# EAGLE design schematic (EAGLE 9.6.2)

## Sheet 1 of 2
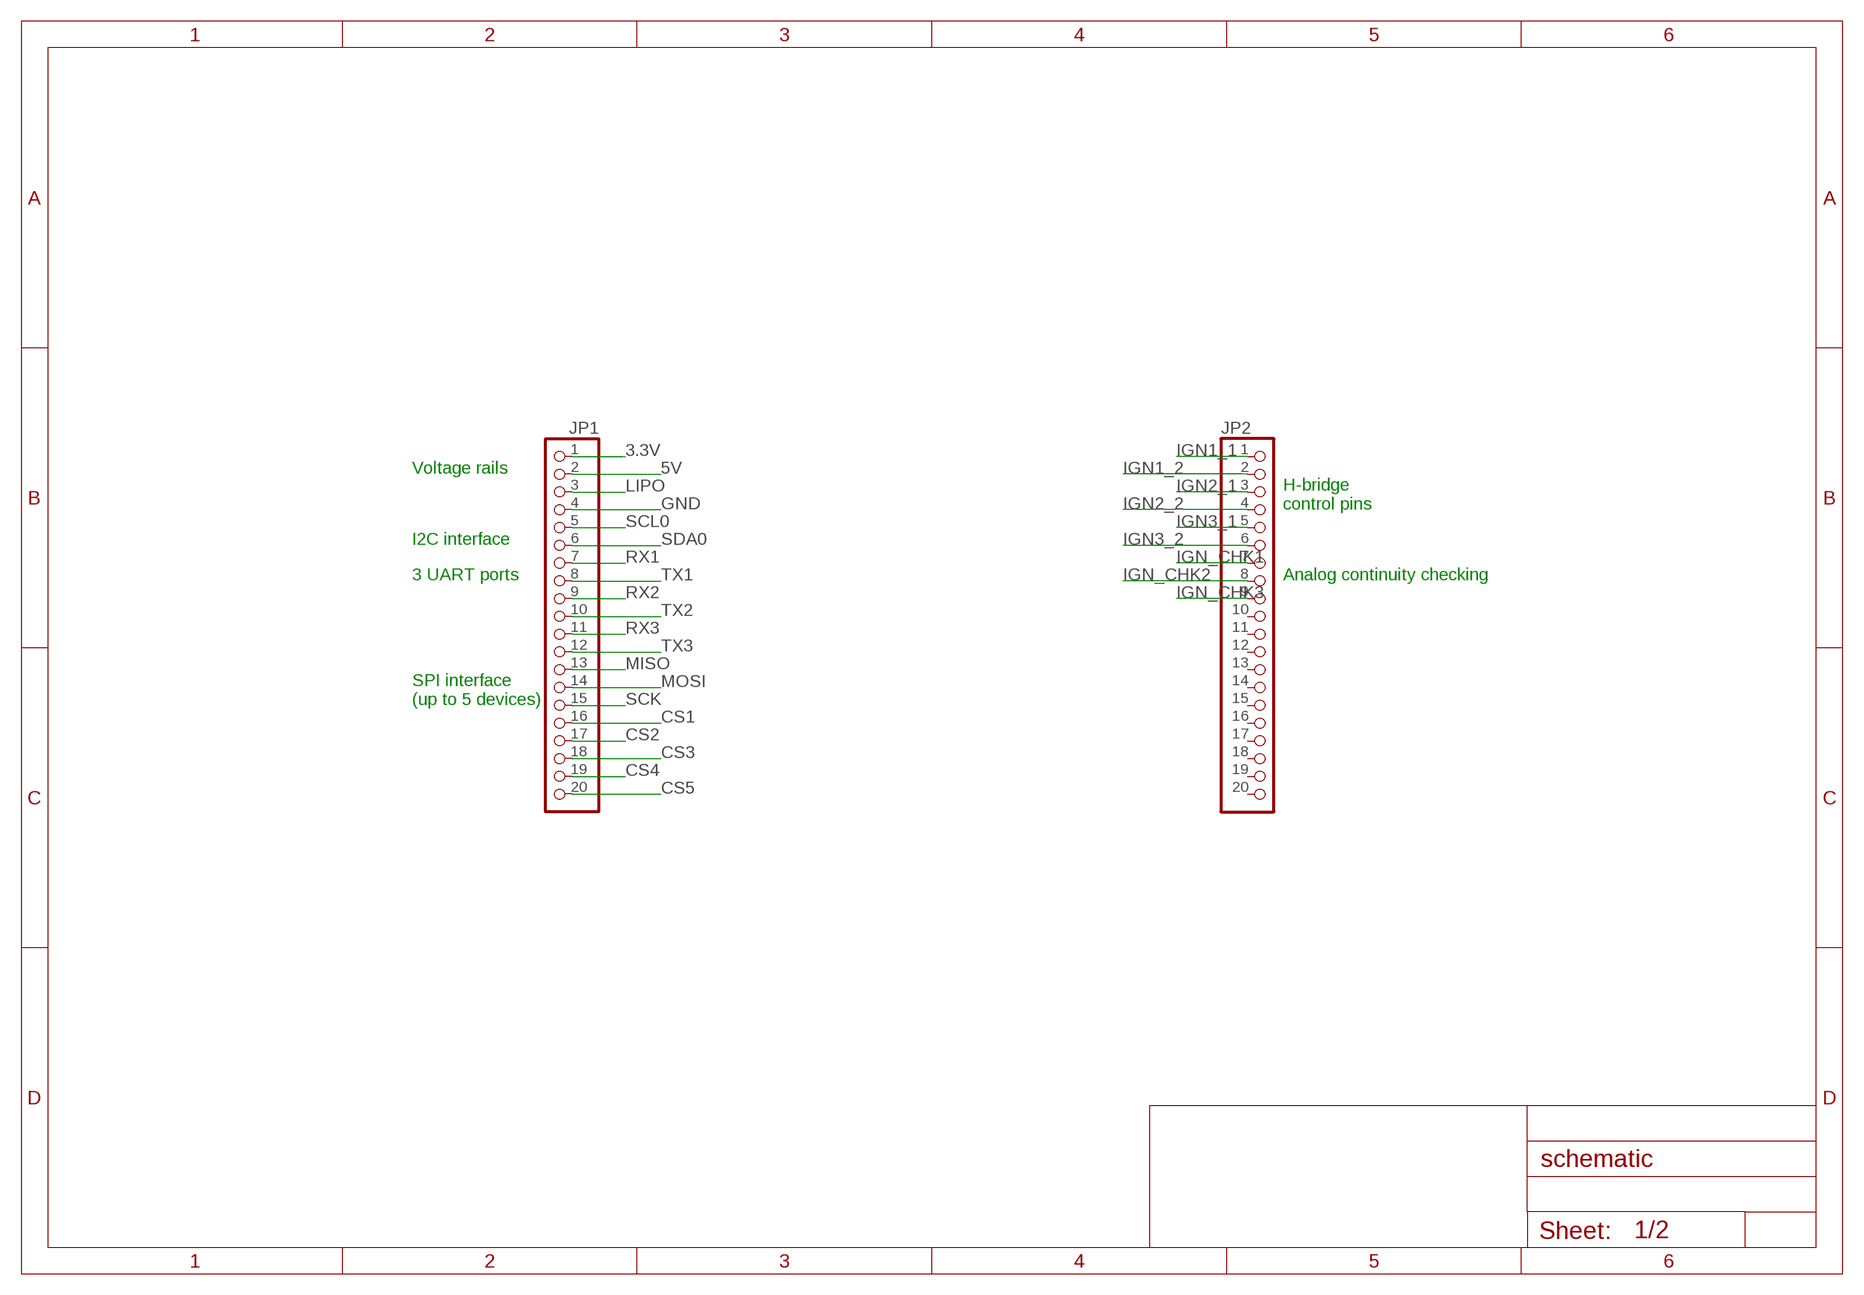
[diagram p0: schematic, sheet 1]

### Parts
JP1  PINHD-1X20  [1X20]
JP2  PINHD-1X20  [1X20]

### Nets
3.3V: JP1.1 ; also sheet 2
5V: JP1.2
CS1: JP1.16
CS2: JP1.17
CS3: JP1.18
CS4: JP1.19
CS5: JP1.20
GND: JP1.4 ; also sheet 2
IGN1_1: JP2.1 ; also sheet 2
IGN1_2: JP2.2 ; also sheet 2
IGN2_1: JP2.3 ; also sheet 2
IGN2_2: JP2.4 ; also sheet 2
IGN3_1: JP2.5 ; also sheet 2
IGN3_2: JP2.6 ; also sheet 2
IGN_CHK1: JP2.7 ; also sheet 2
IGN_CHK2: JP2.8 ; also sheet 2
IGN_CHK3: JP2.9 ; also sheet 2
LIPO: JP1.3 ; also sheet 2
MISO: JP1.13
MOSI: JP1.14
RX1: JP1.7 ; also sheet 2
RX2: JP1.9 ; also sheet 2
RX3: JP1.11
SCK: JP1.15
SCL0: JP1.5 ; also sheet 2
SDA0: JP1.6 ; also sheet 2
TX1: JP1.8 ; also sheet 2
TX2: JP1.10 ; also sheet 2
TX3: JP1.12
Unconnected: JP2.10 JP2.11 JP2.12 JP2.13 JP2.14 JP2.15 JP2.16 JP2.17 JP2.18 JP2.19 JP2.20

### Notes on the sheet
- Voltage rails
- H-bridge
  control pins
- I2C interface
- 3 UART ports | Analog continuity checking
- SPI interface
  (up to 5 devices)

## Sheet 2 of 2
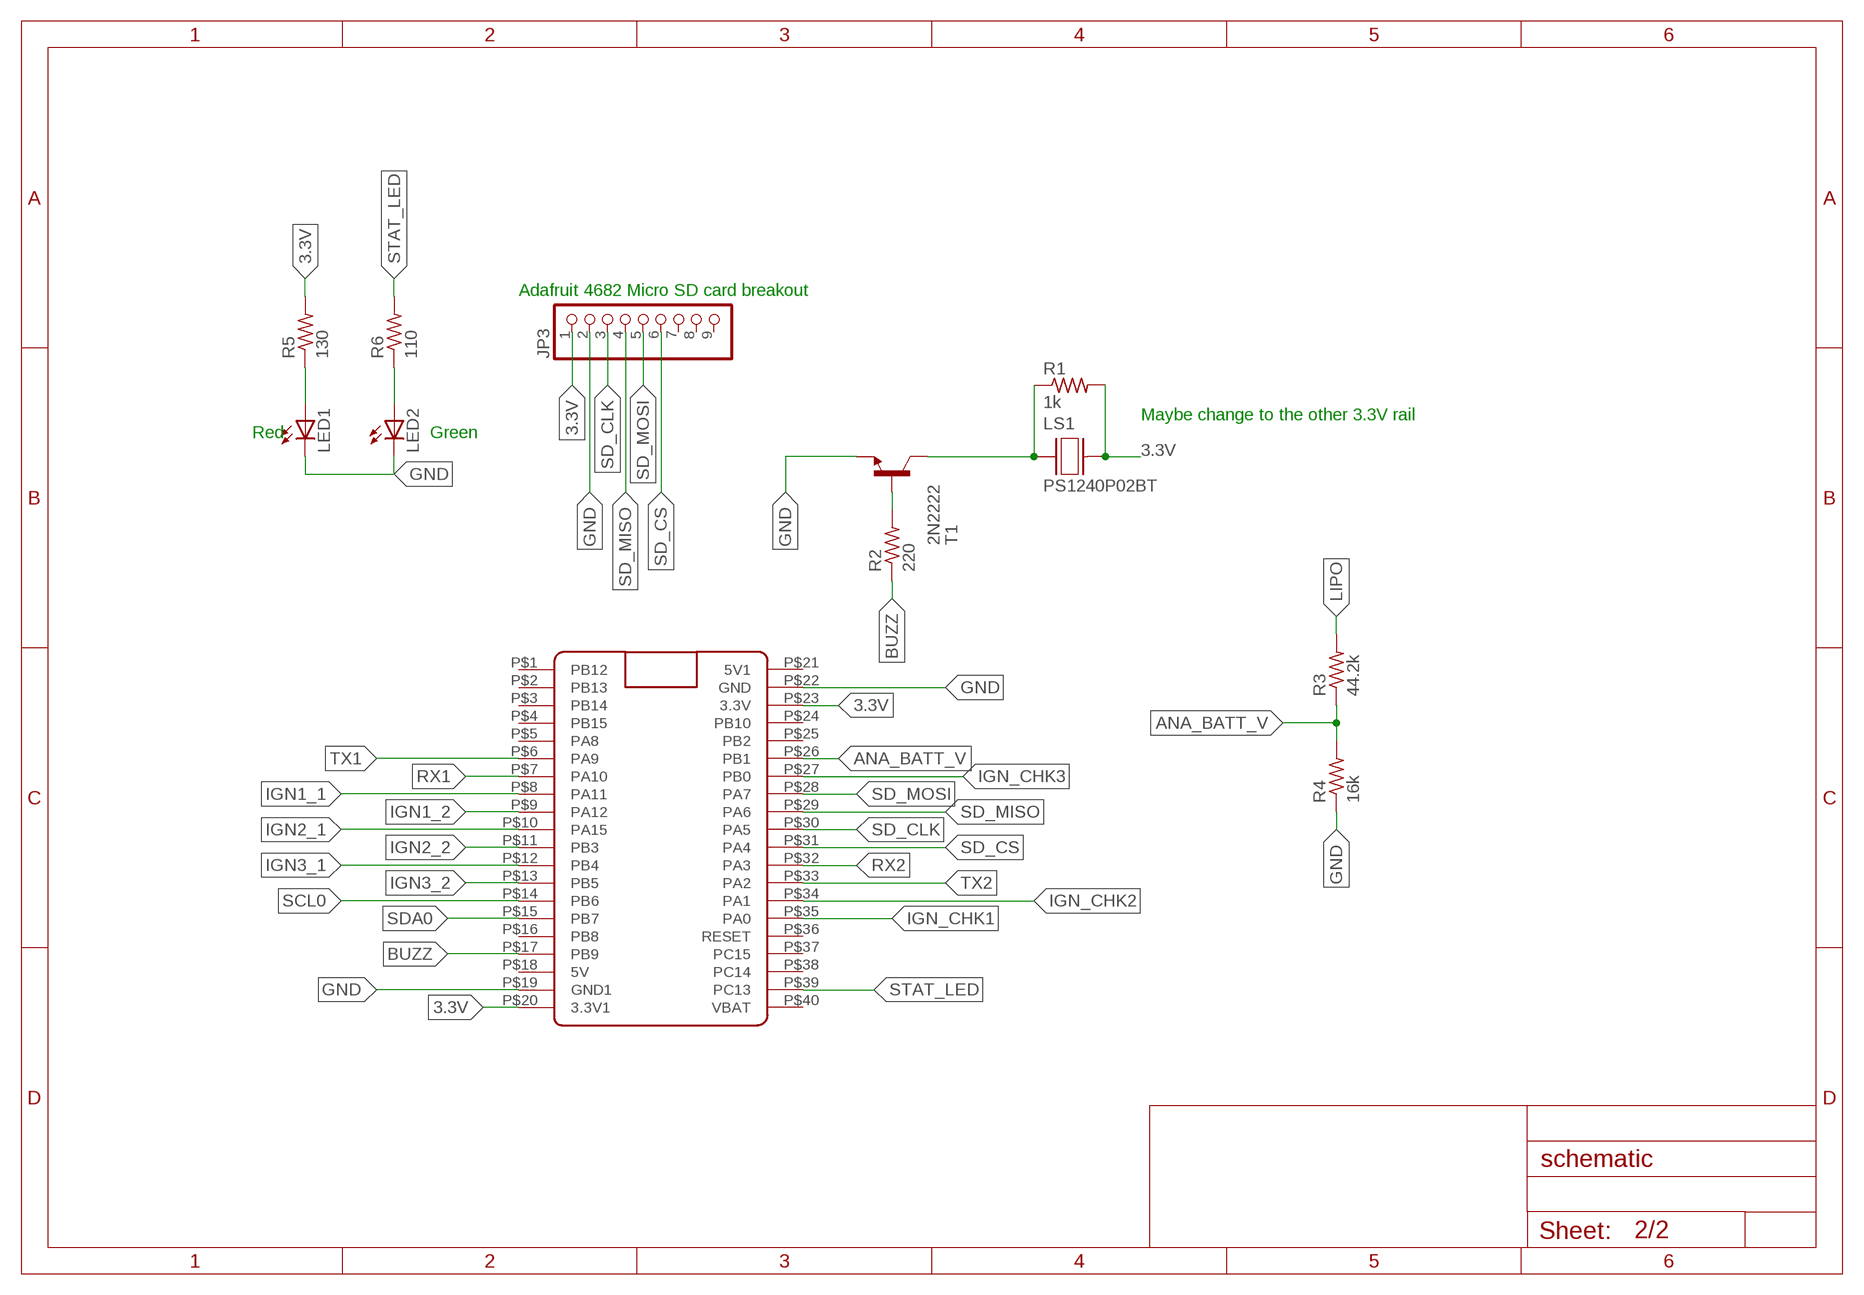
[diagram p1: schematic, sheet 2]

### Parts
JP3  PINHD-1X9  [1X09-BIG]
LED1  LED5MM  [LED5MM]
LED2  LED5MM  [LED5MM]
LS1  PS1240P02BT  [XDCR_PS1240P02BT]
R1  1k  R-US_0204/7  [0204/7]
R2  220  R-US_0204/7  [0204/7]
R3  44.2k  R-US_0204/7  [0204/7]
R4  16k  R-US_0204/7  [0204/7]
R5  130  R-US_0204/7  [0204/7]
R6  110  R-US_0204/7  [0204/7]
T1  2N2222  [TO92-EBC-OVAL]
U$1  BLACK_PILL  [BLACK_PILL]

### Nets
3.3V: JP3.1 LS1.2 R1.2 R5.2 U$1.P$20(3.3V1) U$1.P$23(3.3V) ; also sheet 1
ANA_BATT_V: R3.1 R4.2 U$1.P$26(PB1)
BUZZ: R2.1 U$1.P$17(PB9)
GND: JP3.2 LED1.K(C) LED2.K(C) R4.1 T1.E U$1.P$19(GND1) U$1.P$22(GND) ; also sheet 1
IGN1_1: U$1.P$8(PA11) ; also sheet 1
IGN1_2: U$1.P$9(PA12) ; also sheet 1
IGN2_1: U$1.P$10(PA15) ; also sheet 1
IGN2_2: U$1.P$11(PB3) ; also sheet 1
IGN3_1: U$1.P$12(PB4) ; also sheet 1
IGN3_2: U$1.P$13(PB5) ; also sheet 1
IGN_CHK1: U$1.P$35(PA0) ; also sheet 1
IGN_CHK2: U$1.P$34(PA1) ; also sheet 1
IGN_CHK3: U$1.P$27(PB0) ; also sheet 1
LIPO: R3.2 ; also sheet 1
N$2: LS1.1 R1.1 T1.C
N$3: LED1.A R5.1
N$4: R2.2 T1.B
N$5: LED2.A R6.1
RX1: U$1.P$7(PA10) ; also sheet 1
RX2: U$1.P$32(PA3) ; also sheet 1
SCL0: U$1.P$14(PB6) ; also sheet 1
SD_CLK: JP3.3 U$1.P$30(PA5)
SD_CS: JP3.6 U$1.P$31(PA4)
SD_MISO: JP3.4 U$1.P$29(PA6)
SD_MOSI: JP3.5 U$1.P$28(PA7)
SDA0: U$1.P$15(PB7) ; also sheet 1
STAT_LED: R6.2 U$1.P$39(PC13)
TX1: U$1.P$6(PA9) ; also sheet 1
TX2: U$1.P$33(PA2) ; also sheet 1
Unconnected: JP3.7 JP3.8 JP3.9 U$1.P$1(PB12) U$1.P$2(PB13) U$1.P$3(PB14) U$1.P$4(PB15) U$1.P$5(PA8) U$1.P$16(PB8) U$1.P$18(5V) U$1.P$21(5V1) U$1.P$24(PB10) U$1.P$25(PB2) U$1.P$36(RESET) U$1.P$37(PC15) U$1.P$38(PC14) U$1.P$40(VBAT)

### Notes on the sheet
- Adafruit 4682 Micro SD card breakout
- Maybe change to the other 3.3V rail
- Red | Green

## Library data of the parts
JP1 JP2 = adafruit:PINHD-1X20: PIN HEADER
JP3 = adafruit:PINHD-1X9: Pin header 1x10 0.1" spacing With round pins
LED1 LED2 = adafruit:LED: LED OSRAM: - CHIPLED LG R971, LG N971, LY N971, LG Q971, LY Q971, LO R971, LY R971 LH N974, LH R974 LS Q976, LO Q976, LY Q976 LO Q996 - Hyper CHIPLED LW Q18S LB Q993, LB Q99A, LB R99A - SideLED LS A670, LO A670, LY A670, LG A670, LP A670 LB A673, LV A673, LT A673, LW A673 LH A674 LY A675 LS A676, LA A676, LO A676, LY A676, LW A676 LS A679, LY A679, LG A679 - Hyper Micro SIDELED® LS Y876, LA Y876, LO Y876, LY Y876 LT Y87S - SmartLED LW L88C, LW L88S LB L89C, LB L89S, LG L890 LS L89K, LO L89K, LY L89K LS L896, LA L896, LO L896, LY L896 - TOPLED LS T670, LO T670, LY T670, LG T670, LP T670 LSG T670, LSP T670, LSY T670, LOP T670, LYG T670 LG T671, LOG T671, LSG T671 LB T673, LV T673, LT T673, LW T673 LH T674 LS T676, LA T676, LO T676, LY T676, LB T676, LH T676, LSB T676, LW T676 LB T67C, LV T67C, LT T67C, LS T67K, LO T67K, LY T67K, LW E67C LS E67B, LA E67B, LO E67B, LY E67B, LB E67C, LV E67C, LT E67C LW T67C LS T679, LY T679, LG T679 LS T770, LO T770, LY T770, LG T770, LP T770 LB T773, LV T773, LT T773, LW T773 LH T774 LS E675, LA E675, LY E675, LS T675 LS T776, LA T776, LO T776, LY T776, LB T776 LHGB T686 LT T68C, LB T68C - Hyper Mini TOPLED® LB M676 - Mini TOPLED Santana® LG M470 LS M47K, LO M47K, LY M47K Source: http://www.osram.convergy.de/
LS1 = PS1240P02BT:PS1240P02BT: Buzzers Transducer, Externally Driven Piezo 3V 4kHz 60dB @ 3V, 10cm Through Hole PC Pins Check availability <https://pricing.snapeda.com/parts/PS1240P02BT/TDK/view-part?ref=eda>; AVAILABILITY: In Stock; DESCRIPTION: Buzzers Transducer, Externally Driven Piezo 3 V - 4kHz 60dB @ 3V, 10cm Through Hole PC Pins; MF: TDK; MP: PS1240P02BT; PACKAGE: None; PRICE: None; PURCHASE-URL: https://pricing.snapeda.com/search/part/PS1240P02BT/?ref=eda
R1-R6 = adafruit:R-US_: RESISTOR, American symbol
T1 = adafruit:2N2222: NPN TRANSISTOR Big oval pads
U$1 = BluePill:BLACK_PILL

## Board
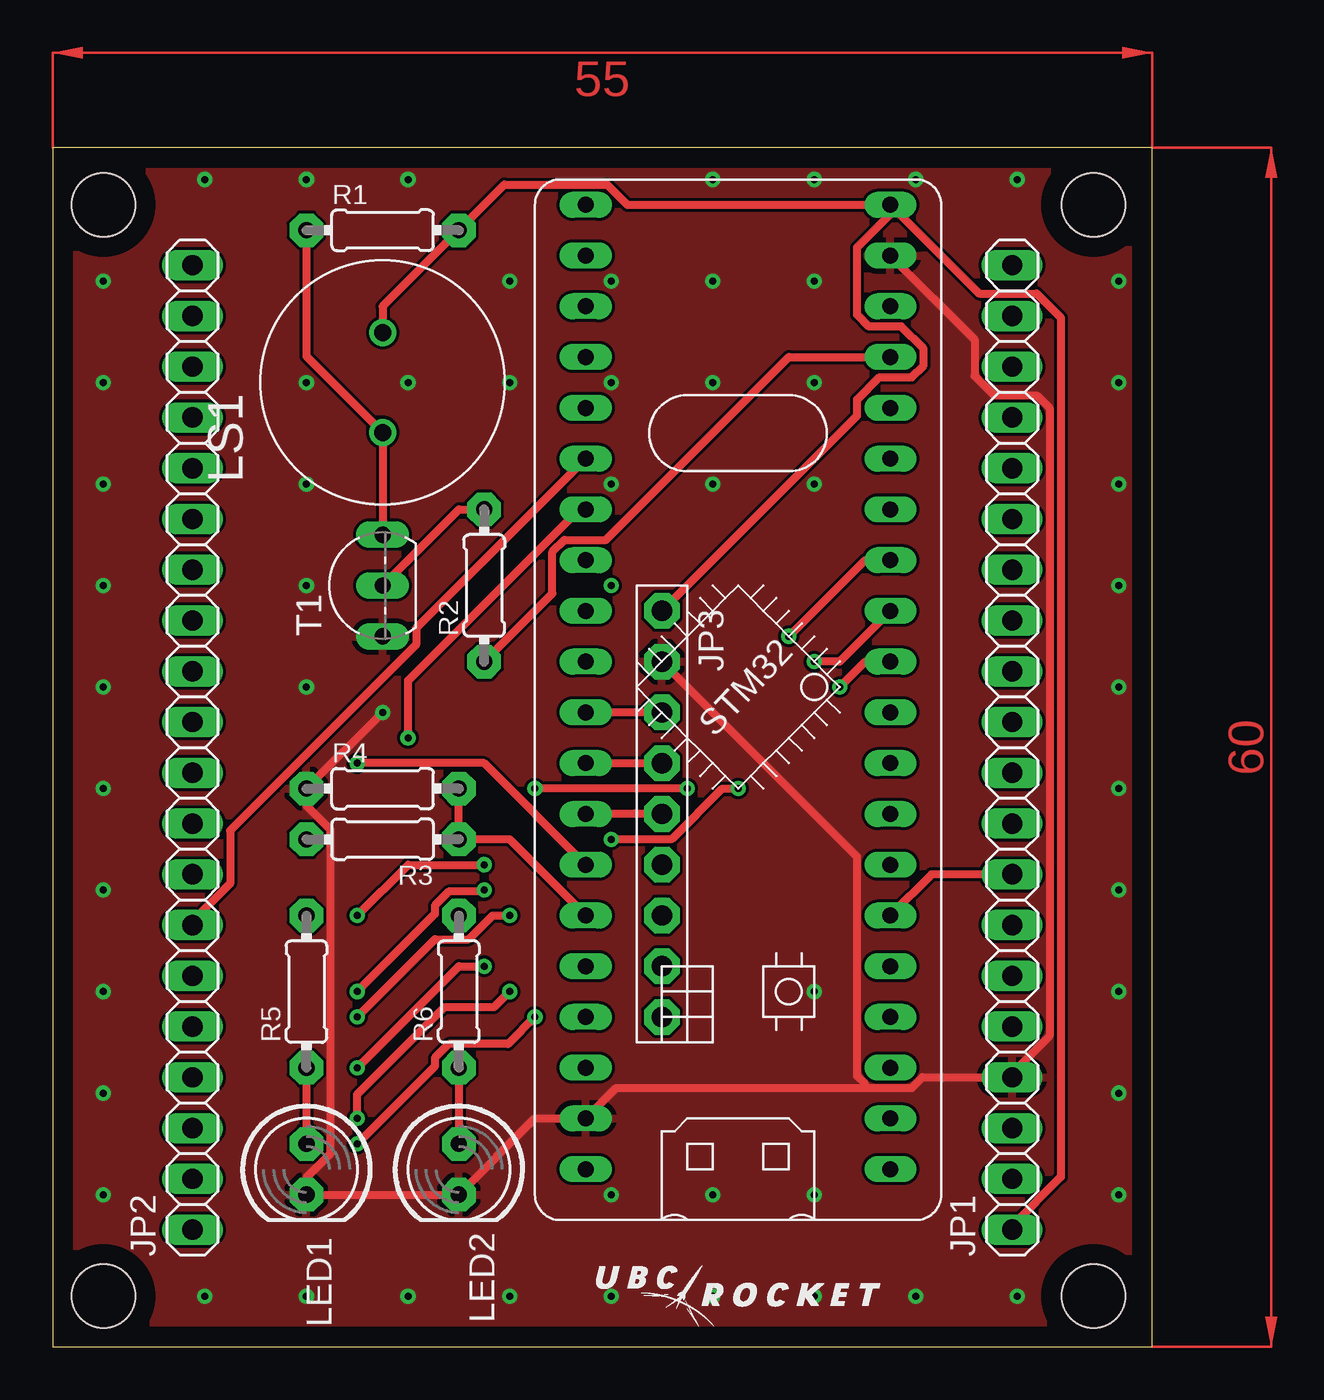
[diagram p2: board, top side]
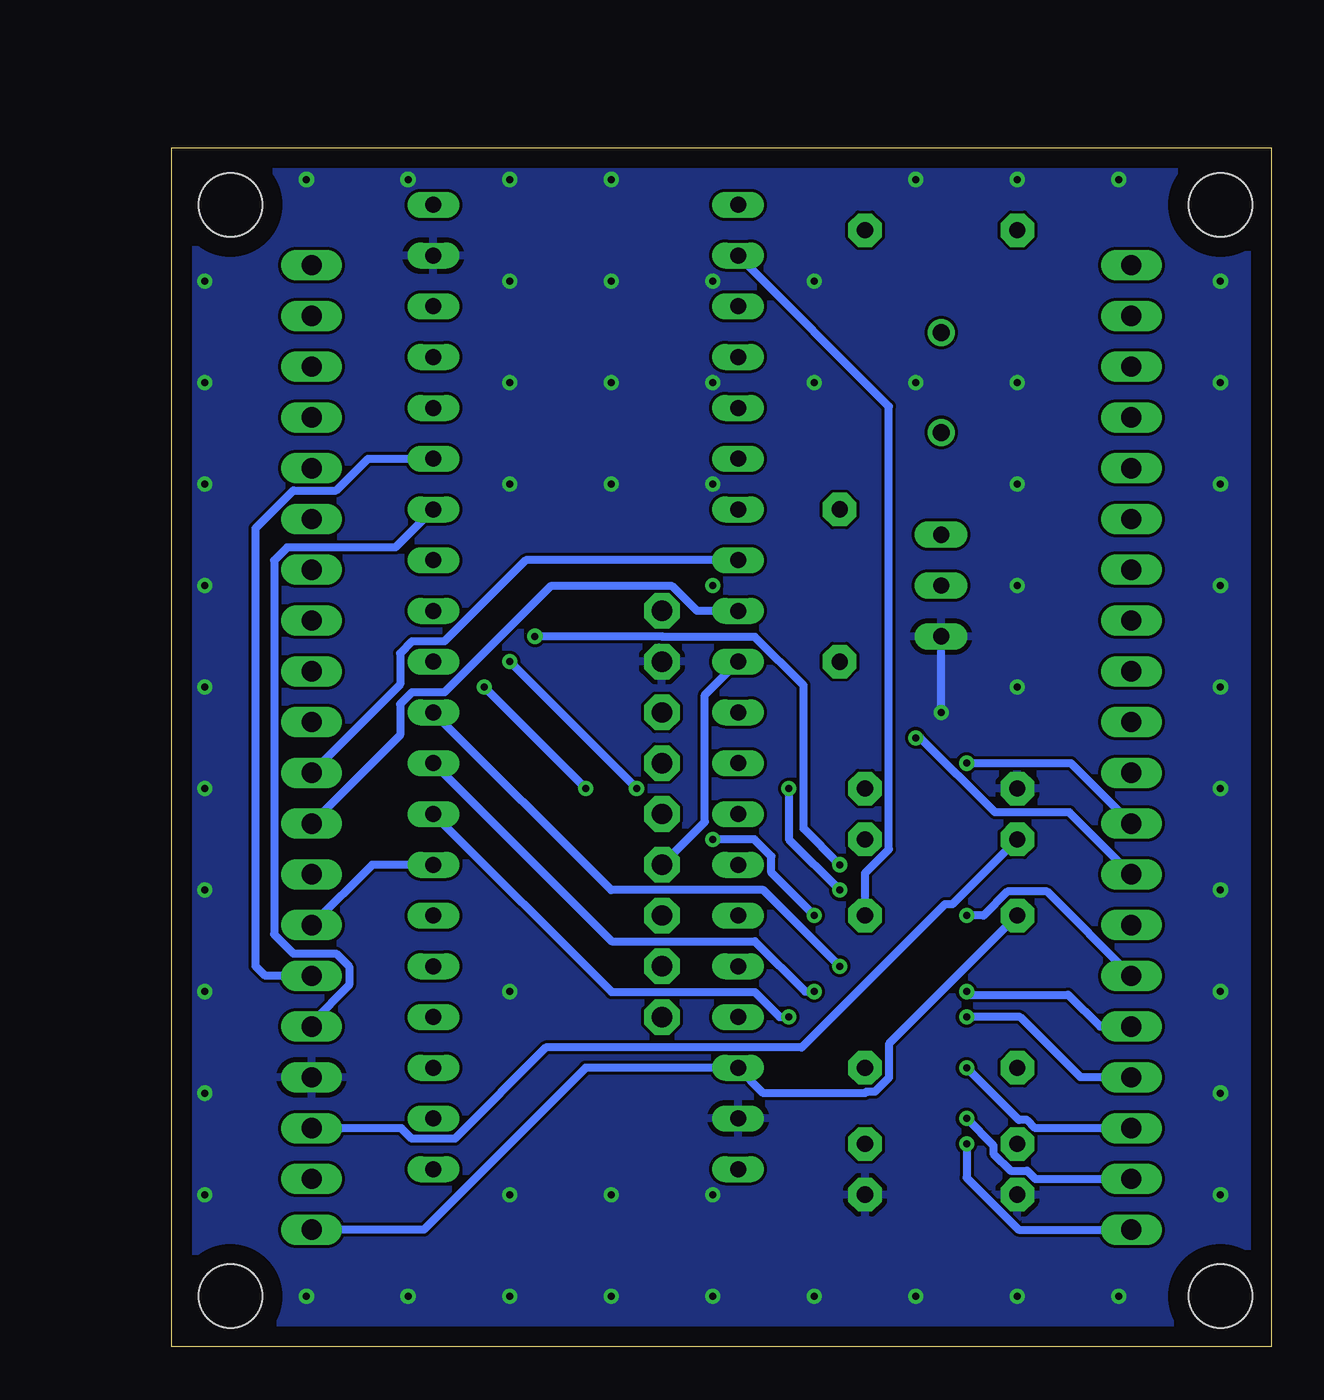
[diagram p3: board, bottom side, seen from below]

Size 55 x 60 mm. Coordinates in mm from the lower left corner, seen from the top.
Outline: 0,0 55,0 55,60 0,60 0,0
Copper layers (1*16): Top 0.035mm / dielectric 1.5mm / Bottom 0.035mm
Design rules "default *": minimum track width 6mil, minimum drill 0.35mm, track to track 6mil, track to pad 6mil, pad to pad 6mil, via to via 6mil, smd to smd 6mil, copper to edge 40mil, drill to drill 6mil, minimum pad ring 10mil, minimum via ring 8mil, stop-mask expansion 4mil, vias tented up to drill 15mil, thermal gap 10mil
Holes 3.17 mm at 2.54,2.54 52.07,2.54 52.07,57.15 2.54,57.15

### Footprints (pad centres in the part's own frame; a part is rotated, then mirrored left to right if it is on the bottom)
1X20 = drill 1.016 long: 1 -24.13,0; 2 -21.59,0; 3 -19.05,0; 4 -16.51,0; 5 -13.97,0; 6 -11.43,0; 7 -8.89,0; 8 -6.35,0; 9 -3.81,0; 10 -1.27,0; 11 1.27,0; 12 3.81,0; 13 6.35,0; 14 8.89,0; 15 11.43,0; 16 13.97,0; 17 16.51,0; 18 19.05,0; 19 21.59,0; 20 24.13,0
1X09-BIG = drill 1.016 pad 1.778 octagon: 1 -10.16,0; 2 -7.62,0; 3 -5.08,0; 4 -2.54,0; 5 0,0; 6 2.54,0; 7 5.08,0; 8 7.62,0; 9 10.16,0
LED5MM = drill 0.813 pad 1.676 octagon: A -1.27,0; K 1.27,0
XDCR_PS1240P02BT = drill 0.85 pad 1.28: 1 -2.5,0; 2 2.5,0
0204/7 = drill 0.813 pad 1.676 octagon: 1 -3.81,0; 2 3.81,0
TO92-EBC-OVAL = drill 0.813 long: B 0,-1.27; C 2.54,-1.27; E -2.54,-1.27
BLACK_PILL = drill 0.8 long: P$1 -7.62,15.24; P$2 -7.62,12.7; P$3 -7.62,10.16; P$4 -7.62,7.62; P$5 -7.62,5.08; P$6 -7.62,2.54; P$7 -7.62,0; P$8 -7.62,-2.54; P$9 -7.62,-5.08; P$10 -7.62,-7.62; P$11 -7.62,-10.16; P$12 -7.62,-12.7; P$13 -7.62,-15.24; P$14 -7.62,-17.78; P$15 -7.62,-20.32; P$16 -7.62,-22.86; P$17 -7.62,-25.4; P$18 -7.62,-27.94; P$19 -7.62,-30.48; P$20 -7.62,-33.02; P$21 7.62,15.24; P$22 7.62,12.7; P$23 7.62,10.16; P$24 7.62,7.62; P$25 7.62,5.08; P$26 7.62,2.54; P$27 7.62,0; P$28 7.62,-2.54; P$29 7.62,-5.08; P$30 7.62,-7.62; P$31 7.62,-10.16; P$32 7.62,-12.7; P$33 7.62,-15.24; P$34 7.62,-17.78; P$35 7.62,-20.32; P$36 7.62,-22.86; P$37 7.62,-25.4; P$38 7.62,-27.94; P$39 7.62,-30.48; P$40 7.62,-33.02

### Placement (x,y rotation side)
JP1  48,30 90 top
JP2  7,30 90 top
JP3  30.48,26.67 270 top
LED1  12.7,8.89 270 top
LED2  20.32,8.89 270 top
LS1  16.51,48.26 90 top
R1  16.51,55.88 0 top
R2  21.59,38.1 90 top
R3  16.51,25.4 180 top
R4  16.51,27.94 0 top
R5  12.7,17.78 90 top
R6  20.32,17.78 90 top
T1  15.24,38.1 90 top
U$1  34.29,24.13 180 top

### Tracks (layer width: path | path; a pad name or v marks a point on that pad's centre or on a via)
3.3V
  Top 0.406: LS1.2 16.51,52.07 R1.2 22.6,58.16 27.74,58.16 28.75,57.15 U$1.P$20 | U$1.P$20 46.35,52.71 49.23,52.71 50.44,51.49 50.44,8.51 48,6.07 JP1.1 | JP3.1 40.25,46.6 40.25,47.41 41.36,48.52 42.98,48.52 43.57,49.11 43.57,49.95 42.46,51.06 40.84,51.06 40.25,51.65 40.25,55.03 41.91,56.69 U$1.P$20
  Bottom 0.406: JP1.1 42.39,5.87 34.29,13.97 U$1.P$23 25.4,12.7 20.32,12.7 20.24,12.78 19.83,12.78 19.13,13.48 19.13,15.16 R5.2
ANA_BATT_V
  Top 0.406: U$1.P$26 22.86,25.4 R3.1 R4.2
BUZZ
  Top 0.406: U$1.P$17 36.83,49.53 27.68,40.38 25.6,40.38 25.01,39.79 25.01,37.71 R2.1
GND  (via drill 0.35)
  Top 0.406: U$1.P$19 46.12,50.4 46.12,48.59 47.08,47.63 49.23,47.63 49.88,46.97 49.88,15.57 48,13.69 JP1.4 43.51,13.49 42.98,12.96 40.64,12.96 | 40.64,12.96 28.2,12.96 U$1.P$22 24.13,11.43 LED2.K LED1.K 12.7,8.47 13.89,9.67 13.89,25.89 12.7,27.09 R4.1 v16.51,31.75 | 40.64,12.96 40.64,13.16 40.25,13.55 40.25,24.52 JP3.2
  Bottom 0.406: v16.51,31.75 T1.E
  other vias: 7.62,58.42 12.7,58.42 17.78,58.42 33.02,58.42 38.1,58.42 43.18,58.42 48.26,58.42 38.1,53.34 33.02,53.34 27.94,53.34 22.86,53.34 22.86,48.26 17.78,48.26 12.7,48.26 2.54,48.26 2.54,53.34 2.54,43.18 12.7,43.18 27.94,43.18 27.94,48.26 33.02,48.26 33.02,43.18 38.1,48.26 38.1,43.18 53.34,48.26 53.34,53.34 53.34,43.18 2.54,38.1 2.54,33.02 2.54,27.94 2.54,22.86 2.54,17.78 2.54,12.7 2.54,7.62 7.62,2.54 12.7,2.54 17.78,2.54 22.86,2.54 27.94,2.54 33.02,2.54 38.1,2.54 43.18,2.54 48.26,2.54 53.34,7.62 53.34,12.7 53.34,17.78 53.34,22.86 53.34,27.94 53.34,33.02 53.34,38.1 38.1,7.62 33.02,7.62 27.94,7.62 38.1,17.78 12.7,33.02 12.7,38.1
  pour Top: 0,59.69 0,0 55.88,0 55.88,59.69
  pour Bottom: 0,59.69 0,0 55.88,0 55.88,59.69
IGN1_1  (via drill 0.35)
  Top 0.406: v24.13,16.51 22.78,15.16 19.83,15.16 19.13,14.46 19.13,14.05 v15.24,10.16
  Bottom 0.406: v24.13,16.51 24.59,16.51 25.83,17.75 32.99,17.75 U$1.P$8 | v15.24,10.16 15.24,8.47 12.64,5.87 JP2.1
IGN1_2  (via drill 0.35)
  Top 0.406: v22.86,17.78 22.07,16.99 19.59,16.99 15.24,12.64 v15.24,11.43
  Bottom 0.406: U$1.P$9 32.99,20.3 25.83,20.3 23.32,17.78 v22.86,17.78 | v15.24,11.43 13.89,10.08 13.89,9.67 13.04,8.81 12.21,8.81 11.8,8.41 JP2.2
IGN2_1  (via drill 0.35)
  Top 0.406: v15.24,13.97 20.32,19.05 v21.59,19.05
  Bottom 0.406: JP2.3 11.8,10.95 12.21,11.35 12.62,11.35 v15.24,13.97 | v21.59,19.05 25.4,22.86 33.02,22.86 U$1.P$10
IGN2_2  (via drill 0.35)
  Top 0.406: v15.24,16.51 19.13,20.4 20.81,20.4 22.01,21.59 v22.86,21.59 | v27.94,25.4 27.96,25.43 31,25.43 33.51,27.94 v34.29,27.94 | v39.37,33.02 40.64,34.29 U$1.P$11
  Bottom 0.406: JP2.4 9.54,13.49 12.56,16.51 v15.24,16.51 | v22.86,21.59 25.01,23.74 25.01,24.55 25.86,25.4 v27.94,25.4 | v34.29,27.94 v39.37,33.02
IGN3_1  (via drill 0.35)
  Top 0.406: U$1.P$12 39.37,34.29 v38.1,34.29 | v31.75,27.94 v24.13,27.94 | v21.59,22.86 21.51,22.78 19.83,22.78 19.13,22.08 19.13,21.67 v15.24,17.78
  Bottom 0.406: v38.1,34.29 v31.75,27.94 | v24.13,27.94 24.13,25.4 v21.59,22.86 | v15.24,17.78 15.09,17.63 10.16,17.63 8.56,16.03 JP2.5
IGN3_2  (via drill 0.35)
  Top 0.406: v15.24,21.59 17.78,24.13 v21.59,24.13 | v36.83,35.56 40.64,39.37 U$1.P$13
  Bottom 0.406: v15.24,21.59 14.39,21.59 13.19,22.78 11.21,22.78 JP2.6 | v21.59,24.13 23.4,25.94 23.4,33.1 25.83,35.53 30.45,35.53 30.48,35.56 v36.83,35.56
IGN_CHK1
  Top 0.406: U$1.P$35 18.19,35.97 18.19,35.14 8.88,25.83 8.88,23.19 7,21.31 JP2.7
IGN_CHK2  (via drill 0.35)
  Top 0.406: U$1.P$34 26.34,41.91 17.78,33.35 v17.78,30.48
  Bottom 0.406: JP2.8 10.1,26.75 13.81,26.75 17.55,30.48 v17.78,30.48
IGN_CHK3  (via drill 0.35)
  Top 0.406: U$1.P$27 21.59,29.21 v15.24,29.21
  Bottom 0.406: v15.24,29.21 10.02,29.21 JP2.9
LIPO
  Bottom 0.406: R3.2 15.95,22.15 16.32,22.15 23.49,14.98 36.28,14.98 40.84,10.42 42.98,10.42 43.51,10.95 JP1.3
N$2
  Top 0.406: R1.1 12.7,49.57 LS1.1 T1.C
N$3
  Top 0.406: R5.1 LED1.A
N$4
  Top 0.406: T1.B 20.32,41.91 R2.2
N$5
  Top 0.406: R6.1 LED2.A
N$58  (via drill 0.35)
  other vias: 27.94,38.1
RX1
  Bottom 0.406: U$1.P$7 44.98,24.13 JP1.7
RX2
  Bottom 0.406: U$1.P$32 28.72,36.83 29.96,38.08 36.04,38.08 41.36,32.76 42.98,32.76 43.57,32.17 43.57,30.62 JP1.9
SCL0
  Bottom 0.406: U$1.P$14 43.81,40.01 49.23,40.01 49.88,39.35 49.88,20.65 48.92,19.69 46.77,19.69 46.12,19.03 46.12,18.11 48,16.23 JP1.5
SD_CLK
  Top 0.406: JP3.3 U$1.P$30
SD_CS
  Bottom 0.406: JP3.6 28.33,26.28 28.33,32.63 U$1.P$31
SD_MISO
  Top 0.406: U$1.P$29 JP3.4
SD_MOSI
  Top 0.406: JP3.5 U$1.P$28
SDA0
  Bottom 0.406: JP1.6 50.32,18.57 50.8,19.05 50.8,40.97 48.92,42.85 46.77,42.85 45.18,44.45 U$1.P$15
STAT_LED
  Bottom 0.406: R6.2 20.32,23.71 19.13,24.91 19.13,47.07 U$1.P$39
TX1
  Top 0.406: JP1.8 43.97,23.65 U$1.P$6
TX2
  Bottom 0.406: JP1.10 43.57,33.16 43.57,34.71 42.98,35.3 41.36,35.3 37.29,39.37 U$1.P$33
(copper drawn outside any net)
  shapes: Top area x2

### Text on the board
tNames: C:/Users/callu/Documents/UBC Rocket/2022 Avionics/image_monochrome.bmp